# EasyEDA schematic SCH_50Hz陷波电路.json
TITLE: 50Hz陷波电路; REV: 1.0; Date: 2022-09-29; Sheet: 1/1; Company: 垃圾桶
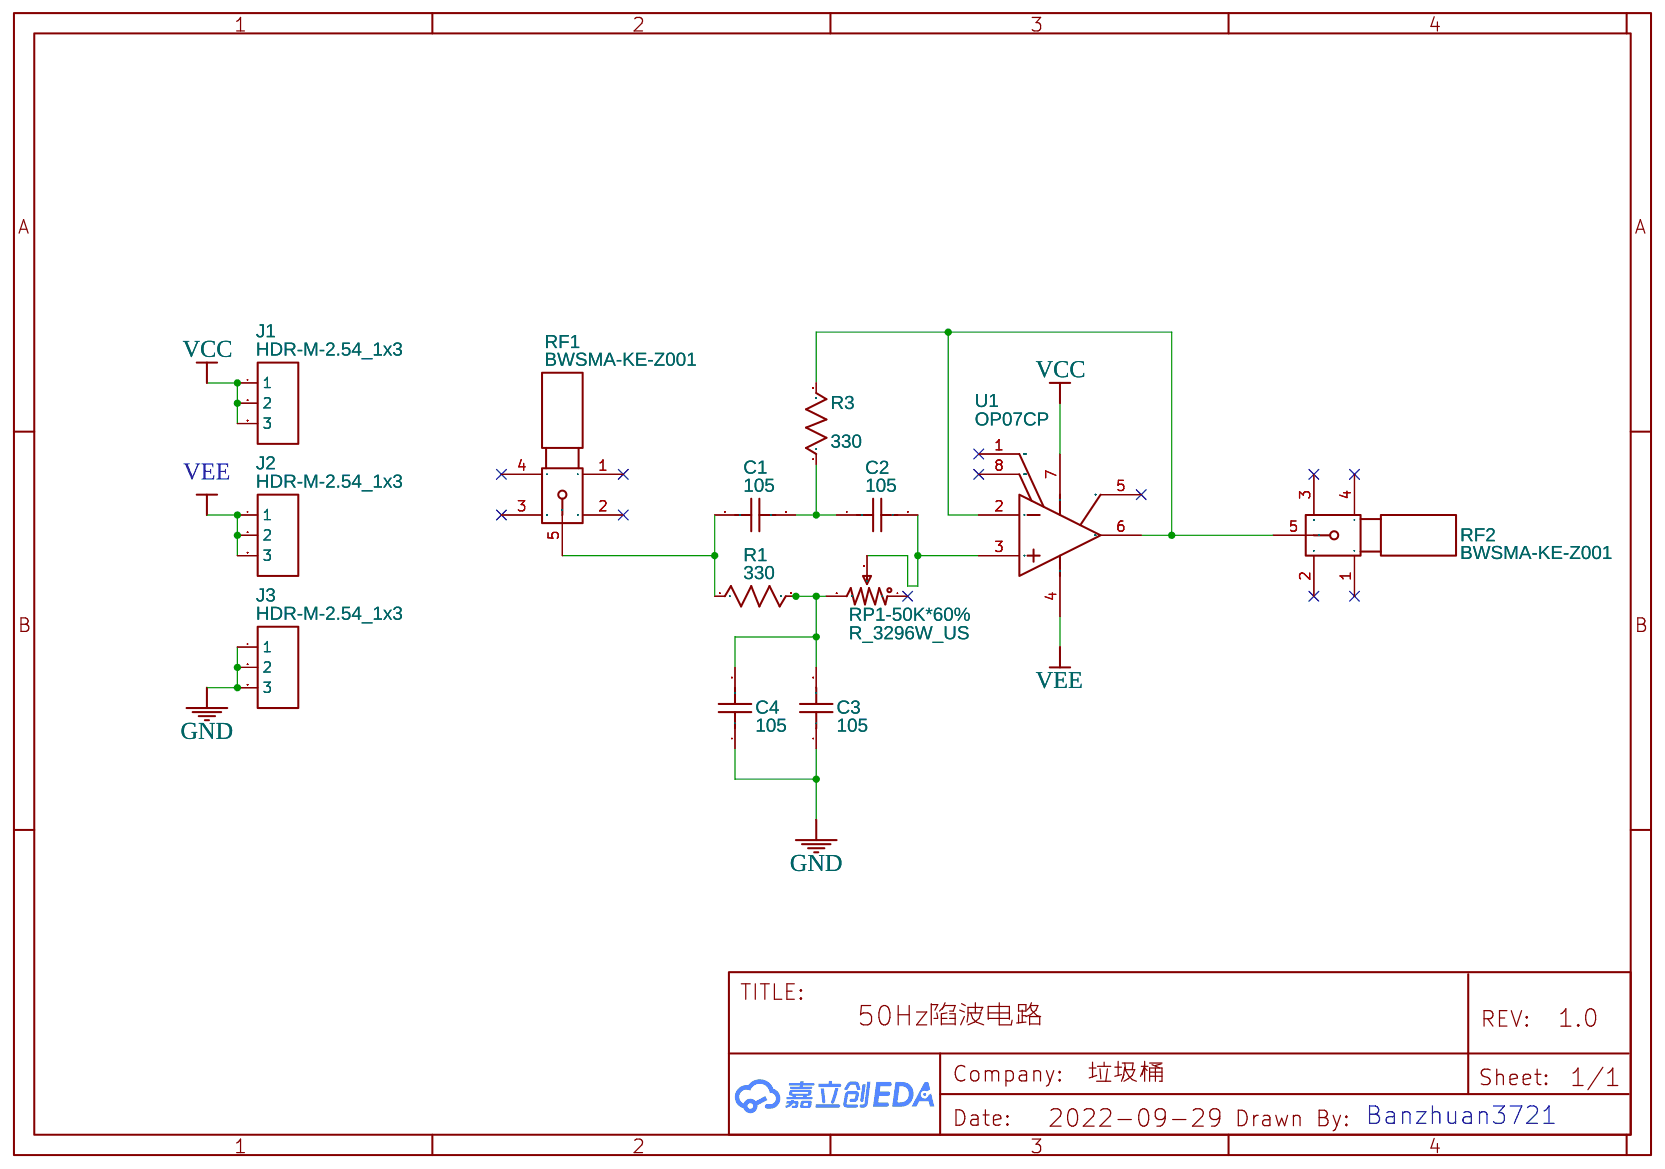
[diagram p0: schematic sheet]

## Parts
C1  105  [RAD-0.2]
C2  105  [RAD-0.2]
C3  105  [RAD-0.2]
C4  105  [RAD-0.2]
J1  HDR-M-2.54_1x3  [HDR-M-2.54_1X3]
J2  HDR-M-2.54_1x3  [HDR-M-2.54_1X3]
J3  HDR-M-2.54_1x3  [HDR-M-2.54_1X3]
R1  330  [R_AXIAL-0.3]
R3  330  [R_AXIAL-0.3]
RF1  BWSMA-KE-Z001  [SMA-TH_BWSMA-KE-Z001]
RF2  BWSMA-KE-Z001  [SMA-TH_BWSMA-KE-Z001]
RP1-50K*60%  R_3296W_US  [RES-ADJ-TH_3296W]
U1  OP07CP  [DIP-8_L9.6-W6.4-P2.54-LS7.6-BL-1]

## Library data of the parts
C1-C4 = C_RAD-0.2_US: Contributor: LCEDA_Lib
J1-J3 = HDR-M-2.54_1x3: Supplier Part: C180248; Supplier: LCSC; Contributor: LCEDA_Lib
R1 R3 = R_AXIAL-0.3_US: Contributor: LCEDA_Lib
RF1 RF2 = BWSMA-KE-Z001: Supplier: LCSC; Supplier Part: C496549; Manufacturer: BAT WIRELESS; Contributor: LCSC; JLCPCB Part Class: Extended Part
RP1-50K*60% = R_3296W_US: Supplier: LCSC; Contributor: LCEDA_Lib; value(Ω): 10K
U1 = OP07CP: Supplier: LCSC; Manufacturer: TI; Supplier Part: C5224; JLCPCB Part Class: Extended Part

## Nets
GND: C3.1 C4.1 J3.1 J3.2 J3.3
VCC: J1.1 J1.2 J1.3 U1.7(VCC+)
VEE: J2.1 J2.2 J2.3 U1.4(VCC-)
Net-(C1-1): C1.1 R1.1 RF1.5
Net-(C1-2): C1.2 C2.1 R3.1
Net-(C2-2): C2.2 RP1-50K*60%.2 U1.3(IN+)
Net-(C3-2): C3.2 C4.2 R1.2 RP1-50K*60%.3
Net-(R3-2): R3.2 RF2.5 U1.2(IN-) U1.6(OUT)

Not connected (* = marked no-connect by the designer): RF1 1* 2* 3* 4*; RF2 1* 2* 3* 4*; RP1-50K*60% 1*; U1 1(OFFSET_N1)* 5(NC)* 8(OFFSET_N2)*

## Notes on the sheet
- Banzhuan3721
